# Altium project radio_module.PrjPcb
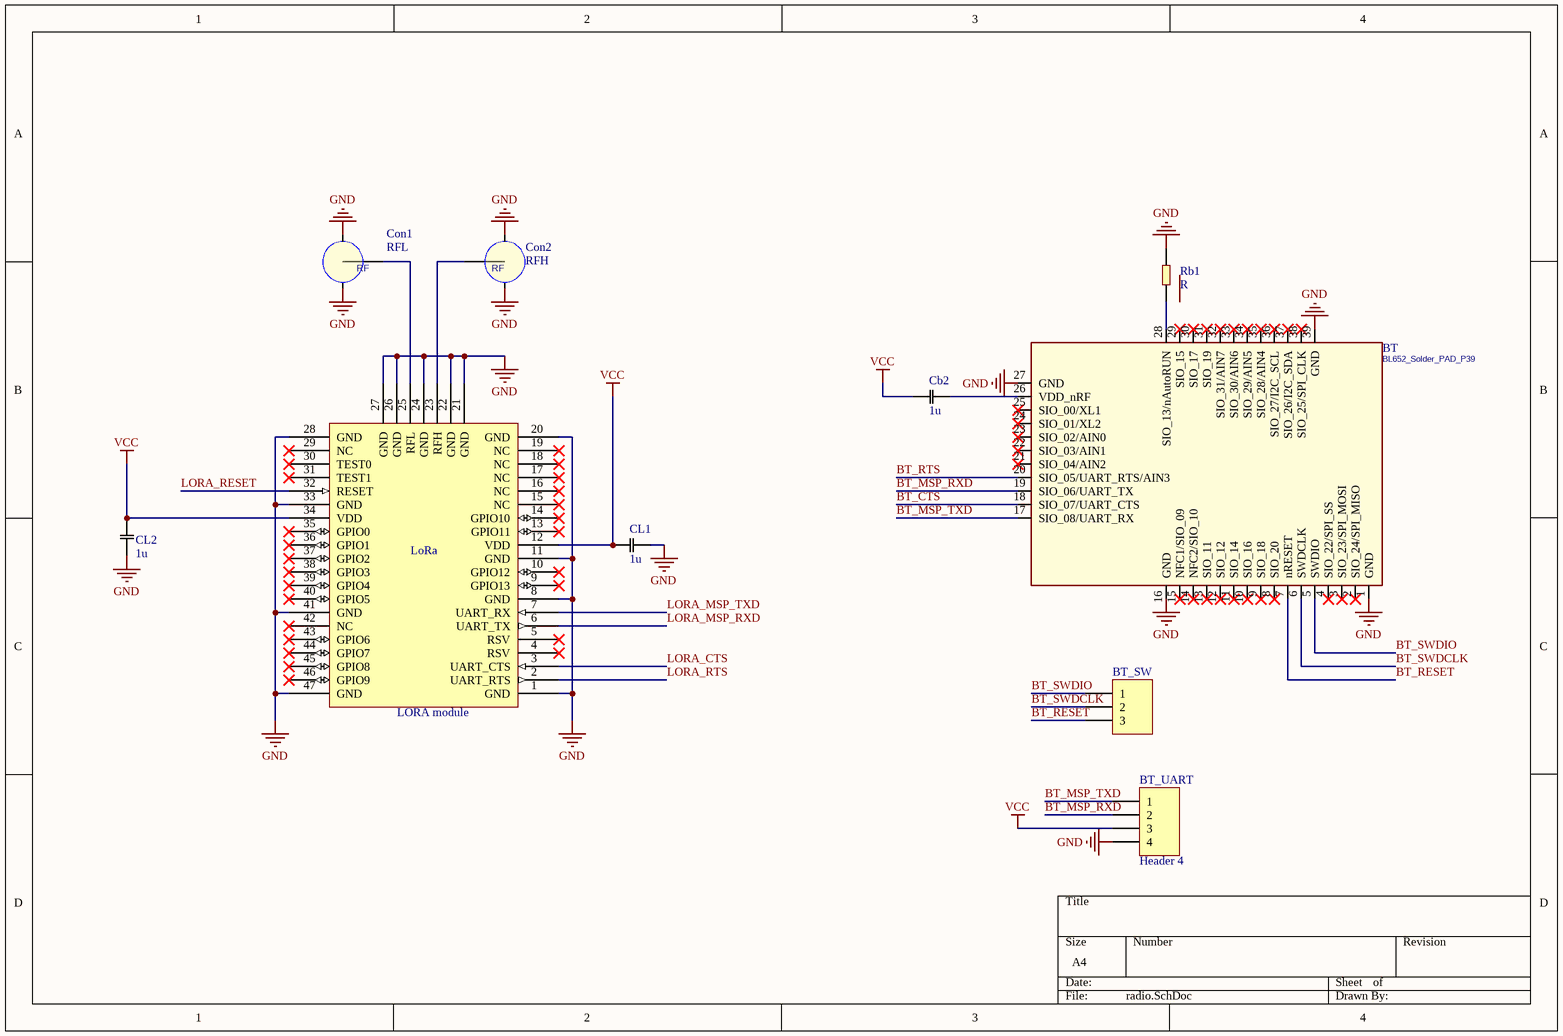
[diagram p0: radio.SchDoc]
3 sheets, 49 parts. Net scope: global (net labels, ports and power ports of the same name join across sheets).
Board file: radio_pcb.PcbDoc
Sheets:
  radio.SchDoc
  pwr_supply.SchDoc
  uC_radio.SchDoc

## Sheet radio.SchDoc
size A4

### Parts
BT  BL652_Solder_PAD_P39  [XCVR_BL652-SA-01]
BT_SW  (no value)  [HDR1X3]
BT_UART  Header 4  [HDR1X4]
Cb2  1u  [603]
CL1  1u  [603]
CL2  1u  [603]
Con1  RFL  [IPEX]
Con2  RFH  [IPEX]
LoRa  LORA module  [RN2483]
Rb1  R  [603]

### Nets
GND: BT.1(GND) BT.16(GND) BT.27(GND) BT.39(GND) BT_UART.4 CL1.2 CL2.1 Con1.2 Con1.3 Con2.2 Con2.3 LoRa.1(GND) LoRa.8(GND) LoRa.11(GND) LoRa.20(GND) LoRa.21(GND) LoRa.22(GND) LoRa.24(GND) LoRa.26(GND) LoRa.27(GND) LoRa.28(GND) LoRa.33(GND) LoRa.41(GND) LoRa.47(GND) Rb1.1
VCC: BT_UART.3 Cb2.1 CL1.1 CL2.2 LoRa.12(VDD) LoRa.34(VDD)
BT_CTS: BT.18(SIO_07/UART_CTS)
BT_MSP_RXD: BT.19(SIO_06/UART_TX) BT_UART.2
BT_MSP_TXD: BT.17(SIO_08/UART_RX) BT_UART.1
BT_RESET: BT.7(nRESET) BT_SW.3
BT_RTS: BT.20(SIO_05/UART_RTS/AIN3)
BT_SWDCLK: BT.6(SWDCLK) BT_SW.2
BT_SWDIO: BT.5(SWDIO) BT_SW.1
LORA_CTS: LoRa.3(UART_CTS)
LORA_MSP_RXD: LoRa.6(UART_TX)
LORA_MSP_TXD: LoRa.7(UART_RX)
LORA_RESET: LoRa.32(RESET)
LORA_RTS: LoRa.2(UART_RTS)
NetBT_26: BT.26(VDD_nRF) Cb2.2
NetBT_28: BT.28(SIO_13/nAutoRUN) Rb1.2
NetCon1_1: Con1.1(RF) LoRa.25(RFL)
NetCon2_1: Con2.1(RF) LoRa.23(RFH)

Not connected (* = marked no-connect by the designer): BT 2(SIO_24/SPI_MISO)* 3(SIO_23/SPI_MOSI)* 4(SIO_22/SPI_SS)* 8(SIO_20)* 9(SIO_18)* 10(SIO_16)* 11(SIO_14)* 12(SIO_12)* 13(SIO_11)* 14(NFC2/SIO_10)* 15(NFC1/SIO_09)* 21(SIO_04/AIN2)* 22(SIO_03/AIN1)* 23(SIO_02/AIN0)* 24(SIO_01/XL2)* 25(SIO_00/XL1)* 29(SIO_15)* 30(SIO_17)* 31(SIO_19)* 32(SIO_31/AIN7)* 33(SIO_30/AIN6)* 34(SIO_29/AIN5)* 35(SIO_28/AIN4)* 36(SIO_27/I2C_SCL)* 37(SIO_26/I2C_SDA)* 38(SIO_25/SPI_CLK)*; LoRa 4(RSV)* 5(RSV)* 9(GPIO13)* 10(GPIO12)* 13(GPIO11)* 14(GPIO10)* 15(NC)* 16(NC)* 17(NC)* 18(NC)* 19(NC)* 29(NC)* 30(TEST0)* 31(TEST1)* 35(GPIO0)* 36(GPIO1)* 37(GPIO2)* 38(GPIO3)* 39(GPIO4)* 40(GPIO5)* 42(NC)* 43(GPIO6)* 44(GPIO7)* 45(GPIO8)* 46(GPIO9)*

### Library data of the parts
BT = BL652_Solder_PAD_P39: BL652 Solder PAD; E Number: ?
BT_SW = Header 3: Header, 3-Pin; LatestRevisionDate: 17-Jul-2002; LatestRevisionNote: Re-released for DXP Platform.; Publisher: Altium Limited
BT_UART = Header 4: Header, 4-Pin; LatestRevisionDate: 17-Jul-2002; LatestRevisionNote: Re-released for DXP Platform.; Publisher: Altium Limited
Cb2 CL1 CL2 = C: Capacitor
Con1 Con2 = IPEX/U.FL: SMA PCB Edge Receptacle
LoRa = Lora
Rb1 = R: Resistor

## Sheet pwr_supply.SchDoc
size A4
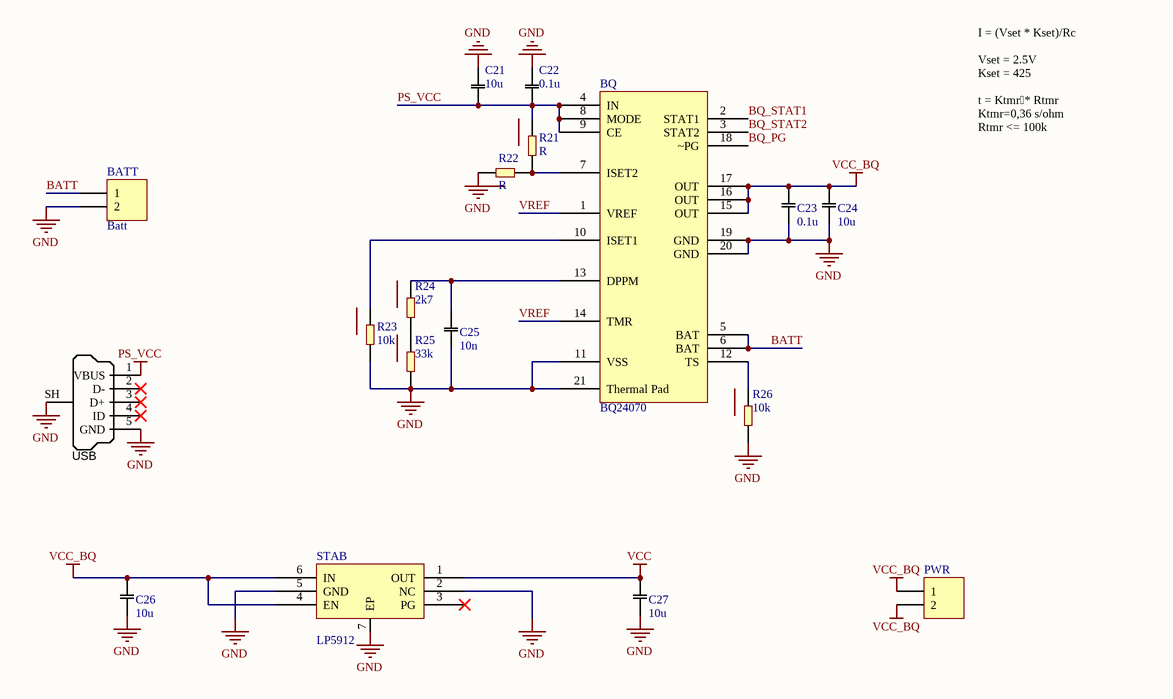
[diagram p1: pwr_supply.SchDoc]

### Parts
BATT  Batt  [HDR1X2]
BQ  BQ24070  [BQ24070]
C21  10u  [603]
C22  0.1u  [603]
C23  0.1u  [603]
C24  10u  [603]
C25  10n  [603]
C26  10u  [402]
C27  10u  [402]
PWR  (no value)  [HDR1X2]
R21  R  [603]
R22  R  [603]
R23  10k  [603]
R24  2k7  [603]
R25  33k  [603]
R26  10k  [603]
STAB  LP5912  [WSON-6]
USB  USB Micro Type B  [USB_Micro-B]  (value not drawn)

### Nets
GND: BATT.2 BQ.11(VSS) BQ.19(GND) BQ.20(GND) BQ.21(Thermal_Pad) C21.2 C22.2 C23.1 C24.1 C25.1 C26.1 C27.1 R22.2 R23.1 R25.1 R26.1 STAB.2(NC) STAB.5(GND) STAB.7(EP) USB.5(GND) USB.SH(Shell)
PS_VCC: BQ.4(IN) BQ.8(MODE) BQ.9(CE) C21.1 C22.1 R21.2 USB.1(VBUS)
VCC: C27.2 STAB.1(OUT)
VCC_BQ: BQ.15(OUT) BQ.16(OUT) BQ.17(OUT) C23.2 C24.2 C26.2 PWR.1 PWR.2 STAB.4(EN) STAB.6(IN)
BATT: BATT.1 BQ.5(BAT) BQ.6(BAT)
BQ_PG: BQ.18(~PG)
BQ_STAT1: BQ.2(STAT1)
BQ_STAT2: BQ.3(STAT2)
VREF: BQ.1(VREF) BQ.14(TMR)
NetBQ_7: BQ.7(ISET2) R21.1 R22.1
NetBQ_10: BQ.10(ISET1) R23.2
NetBQ_12: BQ.12(TS) R26.2
NetBQ_13: BQ.13(DPPM) C25.2 R24.2
NetR24_1: R24.1 R25.2

Not connected (* = marked no-connect by the designer): STAB 3(PG)*; USB 2(D-)* 3(D+)* 4(ID)*

### Notes on the sheet
- I = (Vset * Kset)/Rc
  Vset = 2.5V
  Kset = 425
  t = Ktmr* Rtmr
  Ktmr=0,36 s/ohm
  Rtmr <= 100k

### Library data of the parts
BATT PWR = Header 2: Header, 2-Pin; LatestRevisionDate: 17-Jul-2002; LatestRevisionNote: Re-released for DXP Platform.; Publisher: Altium Limited
C21-C27 = C: Capacitor
R21-R26 = R: Resistor
USB = USB_Micro_TypeB: Connector SMD USB Micro Type B middle mount; Manufacturer 1: Molex Inc; SCDType: undef; Package / Case: SMD; Supplier 1: Digi-Key; Supplier Part Number 1: WM17142CT-ND

## Sheet uC_radio.SchDoc
size A4
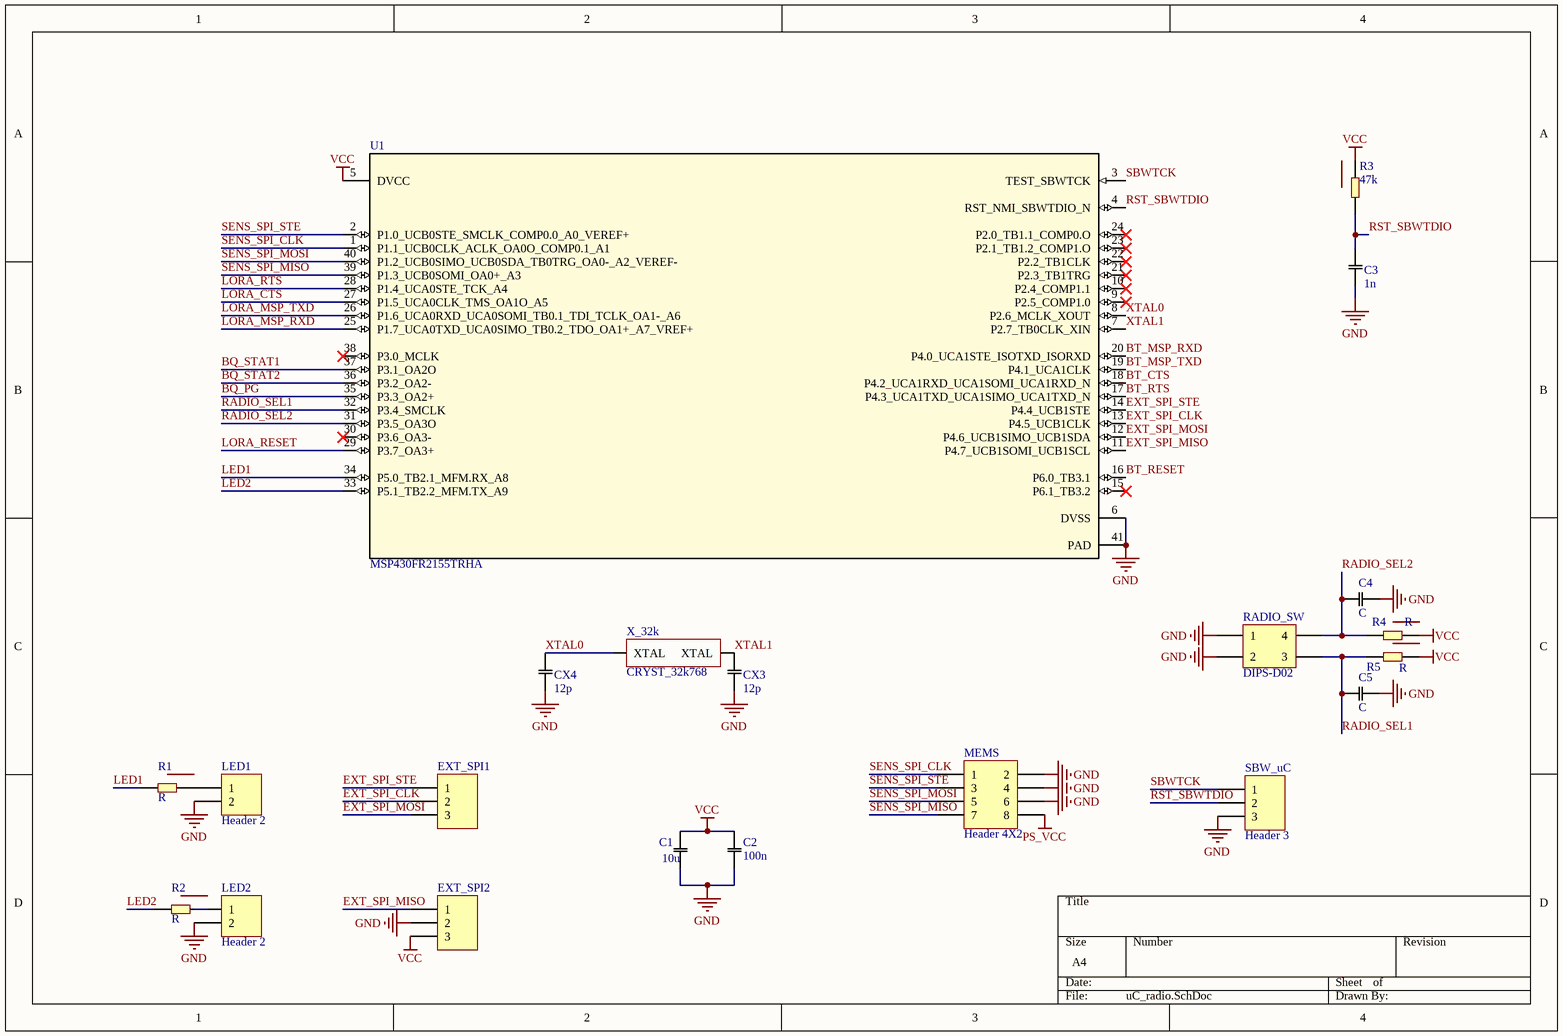
[diagram p2: uC_radio.SchDoc]

### Parts
C1  10u  [402]
C2  100n  [402]
C3  1n  [402]
C4  C  [603]
C5  C  [603]
CX3  12p  [402]
CX4  12p  [402]
EXT_SPI1  (no value)  [HDR1X3]
EXT_SPI2  (no value)  [HDR1X3]
LED1  Header 2  [HDR1X2]
LED2  Header 2  [HDR1X2]
MEMS  Header 4X2  [HDR2X4]
R1  R  [402]
R2  R  [402]
R3  47k  [402]
R4  R  [402]
R5  R  [402]
RADIO_SW  DIPS-D02  [DIPS-02]
SBW_uC  Header 3  [HDR1X3]
U1  MSP430FR2155TRHA  [RHA0040E_NV]
X_32k  CRYST_32k768  [CRYST 32.768 kHz]

### Nets
GND: C1.1 C2.1 C3.1 C4.2 C5.2 CX3.1 CX4.1 EXT_SPI2.2 LED1.2 LED2.2 MEMS.2 MEMS.4 MEMS.6 RADIO_SW.1 RADIO_SW.2 SBW_uC.3 U1.6(DVSS) U1.41(PAD)
PS_VCC: MEMS.8
VCC: C1.2 C2.2 EXT_SPI2.3 R3.2 R4.2 R5.2 U1.5(DVCC)
BQ_PG: U1.35(P3.3_OA2+)
BQ_STAT1: U1.37(P3.1_OA2O)
BQ_STAT2: U1.36(P3.2_OA2-)
BT_CTS: U1.18(P4.2_UCA1RXD_UCA1SOMI_UCA1RXD_N)
BT_MSP_RXD: U1.20(P4.0_UCA1STE_ISOTXD_ISORXD)
BT_MSP_TXD: U1.19(P4.1_UCA1CLK)
BT_RESET: U1.16(P6.0_TB3.1)
BT_RTS: U1.17(P4.3_UCA1TXD_UCA1SIMO_UCA1TXD_N)
EXT_SPI_CLK: EXT_SPI1.2 U1.13(P4.5_UCB1CLK)
EXT_SPI_MISO: EXT_SPI2.1 U1.11(P4.7_UCB1SOMI_UCB1SCL)
EXT_SPI_MOSI: EXT_SPI1.3 U1.12(P4.6_UCB1SIMO_UCB1SDA)
EXT_SPI_STE: EXT_SPI1.1 U1.14(P4.4_UCB1STE)
LED1: R1.1 U1.34(P5.0_TB2.1_MFM.RX_A8)
LED2: R2.1 U1.33(P5.1_TB2.2_MFM.TX_A9)
LORA_CTS: U1.27(P1.5_UCA0CLK_TMS_OA1O_A5)
LORA_MSP_RXD: U1.25(P1.7_UCA0TXD_UCA0SIMO_TB0.2_TDO_OA1+_A7_VREF+)
LORA_MSP_TXD: U1.26(P1.6_UCA0RXD_UCA0SOMI_TB0.1_TDI_TCLK_OA1-_A6)
LORA_RESET: U1.29(P3.7_OA3+)
LORA_RTS: U1.28(P1.4_UCA0STE_TCK_A4)
RADIO_SEL1: C5.1 R5.1 RADIO_SW.3 U1.32(P3.4_SMCLK)
RADIO_SEL2: C4.1 R4.1 RADIO_SW.4 U1.31(P3.5_OA3O)
RST_SBWTDIO: C3.2 R3.1 SBW_uC.2 U1.4(RST_NMI_SBWTDIO_N)
SBWTCK: SBW_uC.1 U1.3(TEST_SBWTCK)
SENS_SPI_CLK: MEMS.1 U1.1(P1.1_UCB0CLK_ACLK_OA0O_COMP0.1_A1)
SENS_SPI_MISO: MEMS.7 U1.39(P1.3_UCB0SOMI_OA0+_A3)
SENS_SPI_MOSI: MEMS.5 U1.40(P1.2_UCB0SIMO_UCB0SDA_TB0TRG_OA0-_A2_VEREF-)
SENS_SPI_STE: MEMS.3 U1.2(P1.0_UCB0STE_SMCLK_COMP0.0_A0_VEREF+)
XTAL0: CX4.2 U1.8(P2.6_MCLK_XOUT) X_32k.2(XTAL)
XTAL1: CX3.2 U1.7(P2.7_TB0CLK_XIN) X_32k.1(XTAL)
NetLED1_1: LED1.1 R1.2
NetLED2_1: LED2.1 R2.2

Not connected (* = marked no-connect by the designer): U1 9(P2.5_COMP1.0)* 10(P2.4_COMP1.1)* 15(P6.1_TB3.2)* 21(P2.3_TB1TRG)* 22(P2.2_TB1CLK)* 23(P2.1_TB1.2_COMP1.O)* 24(P2.0_TB1.1_COMP0.O)* 30(P3.6_OA3-)* 38(P3.0_MCLK)*

### Library data of the parts
C1-C5 CX3 CX4 = C: Capacitor
EXT_SPI1 EXT_SPI2 SBW_uC = Header 3: Header, 3-Pin; LatestRevisionDate: 17-Jul-2002; LatestRevisionNote: Re-released for DXP Platform.; Publisher: Altium Limited
LED1 LED2 = Header 2: Header, 2-Pin; LatestRevisionDate: 17-Jul-2002; LatestRevisionNote: Re-released for DXP Platform.; Publisher: Altium Limited
MEMS = Header 4X2: Header, 4-Pin, Dual row; LatestRevisionDate: 17-Jul-2002; LatestRevisionNote: Re-released for DXP Platform.; Publisher: Altium Limited
R1-R5 = R: Resistor
U1 = MSP430FR2155TRHA: Imported; Manufacturer: Texas Instruments; PartNumber: MSP430FR2355TRHAR; RefDes: RefDes; TYPE: TYPE; Value: Value

## Nets that join several sheets
GND: radio (25 pins), pwr_supply (21 pins), uC_radio (18 pins)
PS_VCC: pwr_supply (7 pins), uC_radio (MEMS.8)
VCC: radio (6 pins), pwr_supply (C27.2 STAB.1), uC_radio (7 pins)
BQ_PG: pwr_supply (BQ.18), uC_radio (U1.35)
BQ_STAT1: pwr_supply (BQ.2), uC_radio (U1.37)
BQ_STAT2: pwr_supply (BQ.3), uC_radio (U1.36)
BT_CTS: radio (BT.18), uC_radio (U1.18)
BT_MSP_RXD: radio (BT.19 BT_UART.2), uC_radio (U1.20)
BT_MSP_TXD: radio (BT.17 BT_UART.1), uC_radio (U1.19)
BT_RESET: radio (BT.7 BT_SW.3), uC_radio (U1.16)
BT_RTS: radio (BT.20), uC_radio (U1.17)
LORA_CTS: radio (LoRa.3), uC_radio (U1.27)
LORA_MSP_RXD: radio (LoRa.6), uC_radio (U1.25)
LORA_MSP_TXD: radio (LoRa.7), uC_radio (U1.26)
LORA_RESET: radio (LoRa.32), uC_radio (U1.29)
LORA_RTS: radio (LoRa.2), uC_radio (U1.28)